# Altium schematic sheet Sheet1.SchDoc
size A3; SheetNumber: 1; SheetTotal: 1
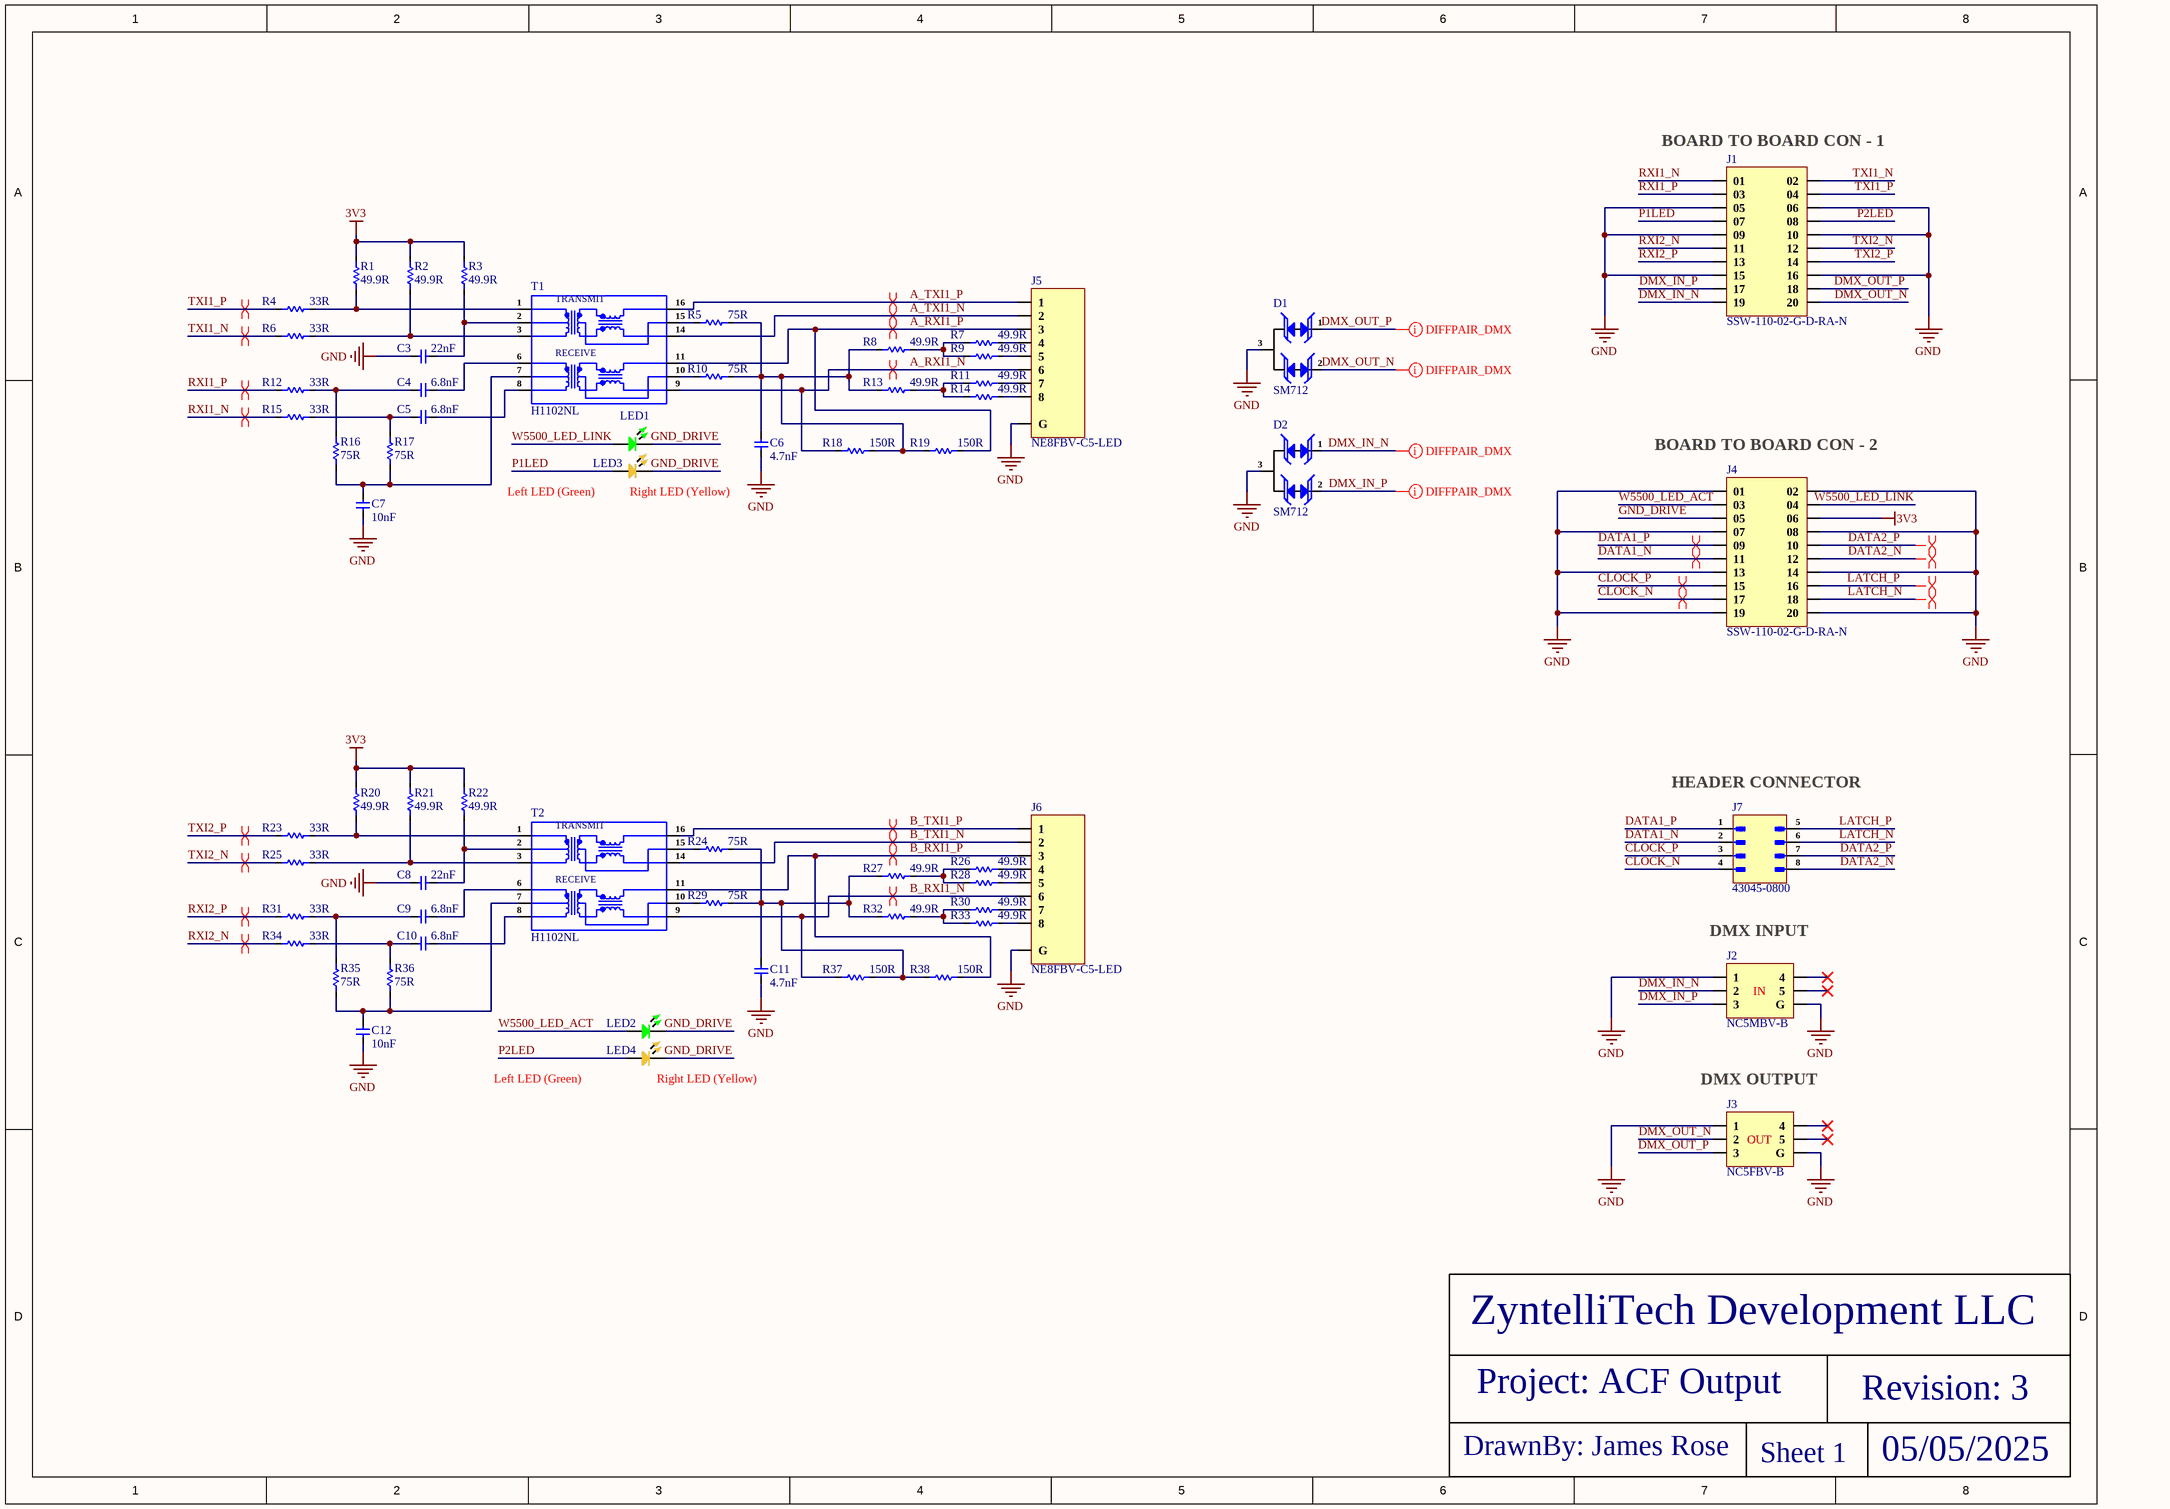
[diagram p0: Sheet1.SchDoc]

## Parts
C3  22nF  [Cap-0603]
C4  6.8nF  [Cap-0603]
C5  6.8nF  [Cap-0603]
C6  4.7nF  [Cap-1206]
C7  10nF  [Cap-0603]
C8  22nF  [Cap-0603]
C9  6.8nF  [Cap-0603]
C10  6.8nF  [Cap-0603]
C11  4.7nF  [Cap-1206]
C12  10nF  [Cap-0603]
D1  SM712  [SOT-23]
D2  SM712  [SOT-23]
J1  SSW-110-02-G-D-RA-N  [SSW-110-02-G-D-RA-N]
J2  NC5MBV-B  [NC5MBV-B]
J3  NC5FBV-B  [NC5FBV-B]
J4  SSW-110-02-G-D-RA-N  [SSW-110-02-G-D-RA-N]
J5  NE8FBV-C5-LED  [NE8FBV-C5-LED]
J6  NE8FBV-C5-LED  [NE8FBV-C5-LED]
J7  43045-0800  [0430450800]
LED1  Emerald  [TH LED 3mm_]  (value not drawn)
LED2  Emerald  [TH LED 3mm_]  (value not drawn)
LED3  Yellow  [TH LED Yellow 3MM]  (value not drawn)
LED4  Yellow  [TH LED Yellow 3MM]  (value not drawn)
R1  49.9R  [Res-0603]
R2  49.9R  [Res-0603]
R3  49.9R  [Res-0603]
R4  33R  [Res-0603]
R5  75R  [Res-0603]
R6  33R  [Res-0603]
R7  49.9R  [Res-0603]
R8  49.9R  [Res-0603]
R9  49.9R  [Res-0603]
R10  75R  [Res-0603]
R11  49.9R  [Res-0603]
R12  33R  [Res-0603]
R13  49.9R  [Res-0603]
R14  49.9R  [Res-0603]
R15  33R  [Res-0603]
R16  75R  [Res-0603]
R17  75R  [Res-0603]
R18  150R  [Res-0603]
R19  150R  [Res-0603]
R20  49.9R  [Res-0603]
R21  49.9R  [Res-0603]
R22  49.9R  [Res-0603]
R23  33R  [Res-0603]
R24  75R  [Res-0603]
R25  33R  [Res-0603]
R26  49.9R  [Res-0603]
R27  49.9R  [Res-0603]
R28  49.9R  [Res-0603]
R29  75R  [Res-0603]
R30  49.9R  [Res-0603]
R31  33R  [Res-0603]
R32  49.9R  [Res-0603]
R33  49.9R  [Res-0603]
R34  33R  [Res-0603]
R35  75R  [Res-0603]
R36  75R  [Res-0603]
R37  150R  [Res-0603]
R38  150R  [Res-0603]
T1  H1102NL  [H1102NLT]
T2  H1102NL  [H1102NLT]

## Nets
3V3: J4.06 R1.1 R2.1 R3.1 R20.1 R21.1 R22.1
GND: C3.1 C6.1 C7.1 C8.1 C11.1 C12.1 D1.3(GND) D2.3(GND) J1.05 J1.06 J1.09 J1.10 J1.15 J1.16 J2.1 J2.G J3.1 J3.G J4.01 J4.02 J4.07 J4.08 J4.13 J4.14 J4.19 J4.20 J5.G J6.G
A_RXI1_N: J5.6 R18.2 T1.9
A_RXI1_P: J5.3 R19.1 T1.11
A_TXI1_N: J5.2 T1.14
A_TXI1_P: J5.1 T1.16
B_RXI1_N: J6.6 R37.2 T2.9
B_RXI1_P: J6.3 R38.1 T2.11
B_TXI1_N: J6.2 T2.14
B_TXI1_P: J6.1 T2.16
CLOCK_N: J4.17 J7.4
CLOCK_P: J4.15 J7.3
DATA1_N: J4.11 J7.2
DATA1_P: J4.09 J7.1
DATA2_N: J4.12 J7.8
DATA2_P: J4.10 J7.7
DMX_IN_N: D2.1(I/O1) J1.19 J2.2
DMX_IN_P: D2.2(I/O2) J1.17 J2.3
DMX_OUT_N: D1.2(I/O2) J1.20 J3.2
DMX_OUT_P: D1.1(I/O1) J1.18 J3.3
GND_DRIVE: J4.05 LED1.1(-) LED2.1(-) LED3.2 LED4.2
LATCH_N: J4.18 J7.6
LATCH_P: J4.16 J7.5
P1LED: J1.07 LED3.1
P2LED: J1.08 LED4.1
RXI1_N: J1.01 R15.1
RXI1_P: J1.03 R12.1
RXI2_N: J1.11 R34.1
RXI2_P: J1.13 R31.1
TXI1_N: J1.02 R6.1
TXI1_P: J1.04 R4.1
TXI2_N: J1.12 R25.1
TXI2_P: J1.14 R23.1
W5500_LED_ACT: J4.03 LED2.2(+)
W5500_LED_LINK: J4.04 LED1.2(+)
NetC3_2: C3.2 R3.2 T1.2
NetC4_1: C4.1 R12.2 R16.1
NetC4_2: C4.2 T1.6
NetC5_1: C5.1 R15.2 R17.1
NetC5_2: C5.2 T1.8
NetC6_2: C6.2 R5.1 R8.2 R10.1 R13.2 R18.1 R19.2
NetC7_2: C7.2 R16.2 R17.2 T1.7
NetC8_2: C8.2 R22.2 T2.2
NetC9_1: C9.1 R31.2 R35.1
NetC9_2: C9.2 T2.6
NetC10_1: C10.1 R34.2 R36.1
NetC10_2: C10.2 T2.8
NetC11_2: C11.2 R24.1 R27.2 R29.1 R32.2 R37.1 R38.2
NetC12_2: C12.2 R35.2 R36.2 T2.7
NetJ5_4: J5.4 R7.1
NetJ5_5: J5.5 R9.1
NetJ5_7: J5.7 R11.1
NetJ5_8: J5.8 R14.1
NetJ6_4: J6.4 R26.1
NetJ6_5: J6.5 R28.1
NetJ6_7: J6.7 R30.1
NetJ6_8: J6.8 R33.1
NetR1_2: R1.2 R4.2 T1.1
NetR2_2: R2.2 R6.2 T1.3
NetR5_2: R5.2 T1.15
NetR7_2: R7.2 R8.1 R9.2
NetR10_2: R10.2 T1.10
NetR11_2: R11.2 R13.1 R14.2
NetR20_2: R20.2 R23.2 T2.1
NetR21_2: R21.2 R25.2 T2.3
NetR24_2: R24.2 T2.15
NetR26_2: R26.2 R27.1 R28.2
NetR29_2: R29.2 T2.10
NetR30_2: R30.2 R32.1 R33.2

Not connected (* = marked no-connect by the designer): J2 4* 5*; J3 4* 5*

## Layout directives
differential pair; differential pair class DIFF-ETH-100; rule Impedance Constraint [Min = 100.0    Max = 110.0    ]; rule Matched Net Lengths [Tolerance = 0.508mm]: A_RXI1_N, A_RXI1_P, A_TXI1_N, A_TXI1_P, B_RXI1_N, B_RXI1_P, B_TXI1_N, B_TXI1_P, CLOCK_N, CLOCK_P, DATA1_N, DATA1_P, DATA2_N, DATA2_P, LATCH_N, LATCH_P, RXI1_N, RXI1_P, RXI2_N, RXI2_P, TXI1_N, TXI1_P, TXI2_N, TXI2_P
differential pair; differential pair class DIFF-DMX-120; rule Impedance Constraint [Min = 110.0    Max = 120.0    ]; rule Matched Net Lengths [Tolerance = 0.508mm]: DMX_IN_N, DMX_IN_P, DMX_OUT_N, DMX_OUT_P

## Notes on the sheet
- (near J1) BOARD TO BOARD CON - 1
- (near J4) BOARD TO BOARD CON - 2
- (near LED3) Left LED (Green)
- (near LED3) Right LED (Yellow)
- (near J7) HEADER CONNECTOR
- (near J2) IN
- DMX INPUT
- Left LED (Green)
- (near LED4) Right LED (Yellow)
- (near J3) DMX OUTPUT
- (near J3) OUT
- ZyntelliTech Development LLC
- Project: ACF Output
- DrawnBy: James Rose
- Revision: 3
- Sheet 1
- 05/05/2025
- ZyntelliTech
- File:
- Title:
- Date:
- Page
- Num:
- Total:
- Drawn By: Huzaifa Ali
- (in symbol H1102NL) TRANSMIT; RECEIVE

## Library data of the parts
C3 C8 = CC0603KRX7R9BB223: CAP CER 0.022UF 50V X7R 0603; Manufacturer: Yageo; Dielectric Material: Ceramic; Tolerance: 10%; Insulation Resistance: 100GR; Item Type: Capacitor; Supplier 1: Digi-Key; Manufacturer Part Number: CC0603KRX7R9BB223; RoHS: Yes; Category: Ceramic Capacitors; Stock 1: 119735; Pricing 1: 1=0.10000, 10=0.05500, 50=0.03020, 100=0.02460, 500=0.01760, 1000=0.01383 (USD); Mount: Surface Mount; Case/Package: 0603; Number of Pins: 2; Case Code (Metric): 1608; Case Code (Imperial): 0603; Min Operating Temperature: -55°C; Max Operating Temperature: 125°C; Capacitance: 22nF; Dielectric: X7R; Voltage: 50V; Package Quantity: 1; Voltage Rating: 50V; Packaging: Tape and Reel; Voltage Rating (DC): 50V; Termination: SMD/SMT; Resistor Type: Ceramic; Series: CC; Length: 1.6mm; Width: 0.031inch; Height: 0.8mm; Depth: 0.8mm; Thickness: 0.035inch; Radiation Hardening: No; RoHS Compliant: Yes; REACH SVHC: No SVHC; Lead Free: Lead Free; Halogen Free: Halogen Free; ComponentLink1URL: https://datasheet.ciiva.com/8033/70765-8033869.pdf?src-supplier=Element14; ComponentLink1Description: https://datasheet.ciiva.com/8033/70765-8033869.pdf?src-supplier=Element14; ComponentLink2URL: https://datasheet.ciiva.com/28450/1489800-28450639.pdf?src-supplier=Element14; ComponentLink2Description: https://datasheet.ciiva.com/28450/1489800-28450639.pdf?src-supplier=Element14; ComponentLink3URL: https://datasheet.ciiva.com/8033/1489800-8033867.pdf?src-supplier=Element14; ComponentLink3Description: https://datasheet.ciiva.com/8033/1489800-8033867.pdf?src-supplier=Element14; ComponentLink4URL: https://datasheet.ciiva.com/8033/1489800-8033865.pdf?src-supplier=Element14; ComponentLink4Description: https://datasheet.ciiva.com/8033/1489800-8033865.pdf?src-supplier=Element14; ComponentLink5URL: https://datasheet.ciiva.com/156/mlccorderingcode-156178.pdf?src-supplier=Digi-Key; ComponentLink5Description: https://datasheet.ciiva.com/156/mlccorderingcode-156178.pdf?src-supplier=Digi-Key; ComponentLink6URL: https://datasheet.ciiva.com/156/mlccorderingcode-156177.pdf?src-supplier=Digi-Key; ComponentLink6Description: https://datasheet.ciiva.com/156/mlccorderingcode-156177.pdf?src-supplier=Digi-Key; ComponentLink7URL: https://datasheet.ciiva.com/156/mlccorderingcode-156179.pdf?src-supplier=Digi-Key; ComponentLink7Description: https://datasheet.ciiva.com/156/mlccorderingcode-156179.pdf?src-supplier=Digi-Key; ComponentLink8URL: https://datasheet.ciiva.com/11464/upy-gphc-x7r-6-3v-to-50v-8-11464741.pdf?src-supplier=Avnet; ComponentLink8Description: https://datasheet.ciiva.com/11464/upy-gphc-x7r-6-3v-to-50v-8-11464741.pdf?src-supplier=Avnet; Supplier Part Number 1: 311-1370-1-ND; LCSC Part Number: C106222
C4 C5 C9 C10 = 0603B682K500NT: 50V 6.8nF X7R ±10% 0603; Manufacturer: FH; Item Type: Capacitor; ComponentLink1Description: LCSC; ComponentLink1URL: https://www.lcsc.com/product-detail/Multilayer-Ceramic-Capacitors-MLCC-SMD-SMT_FH-Guangdong-Fenghua-Advanced-Tech-0603B682K500NT_C1631.html; Manufacturer Part Number: 0603B682K500NT; Footprint: 0603; Value: 6.8nF; LCSC Part Number: C1631
C6 C11 = CC1206KKX7RCBB472: CAP CER 4700PF 1KV X7R 1206; Manufacturer: Yageo; Dielectric Material: Ceramic; Tolerance: 10%; Item Type: Capacitor; Supplier 1: Future Electronics; Manufacturer Part Number: CC1206KKX7RCBB472; RoHS: Yes; Category: Ceramic Capacitors; Stock 1: 180000; Pricing 1: 3000=0.02860, 9000=0.02750, 15000=0.02700, 45000=0.02600, 75000=0.02510 (USD); Mount: Surface Mount; Case/Package: 1206; Number of Pins: 2; Case Code (Imperial): 1206; Case Code (Metric): 3216; Weight: 0.000571oz; Min Operating Temperature: -55°C; Max Operating Temperature: 125°C; Voltage Rating: 1kV; Capacitance: 4.7nF; Packaging: Tape and Reel; Voltage Rating (DC): 1kV; Dielectric: X7R; Termination: SMD/SMT; Resistor Type: Ceramic; Series: CC; Length: 3.2mm; Width: 0.063inch; Thickness: 0.057inch; Depth: 1.6mm; Radiation Hardening: No; Lead Free: Lead Free; RoHS Compliant: Yes; ComponentLink1URL: https://datasheet.ciiva.com/13208/upy-gp-np0-16v-to-50v-8-13208693.pdf?src-supplier=Mouser; ComponentLink1Description: https://datasheet.ciiva.com/13208/upy-gp-np0-16v-to-50v-8-13208693.pdf?src-supplier=Mouser; ComponentLink2URL: https://datasheet.ciiva.com/11466/hv-11466701.pdf?src-supplier=Avnet; ComponentLink2Description: https://datasheet.ciiva.com/11466/hv-11466701.pdf?src-supplier=Avnet; Supplier Part Number 1: 7130131; LCSC Part Number: C107198
C7 C12 = CC0603KRX7R0BB103: CAP CER 10000PF 100V X7R 0603; Manufacturer: Yageo; Item Type: Capacitor; Dielectric Material: Ceramic; Tolerance: 10%; Supplier: Future Electronics; LCSC Part Number: C107059; Manufacturer Part Number: CC0603KRX7R0BB103; RoHS: Yes; Stock: 788000; Pricing: 4000=0.0051, 16000=0.0048, 60000=0.0045, 160000=0.0043, 400000=0.0041 (USD); Mounting Technology: Surface Mount; Case/Package: 0603; Case Code (Imperial): 0603; Case Code (Metric): 1608; Min Operating Temperature: -55°C; Max Operating Temperature: 125°C; Value: 10nF; Dielectric: X7R; Voltage Rating: 100V; Packaging: Tape and Reel; Package Quantity: 4000; Voltage Rating (DC): 100V; Termination: SMD/SMT; Series: CC; Construction: Flat; Length: 1.6mm; Width: 0.031inch; Height: 0.8mm; Thickness: 0.035inch; Depth: 0.8mm; Radiation Hardening: No; Lead Free: Lead Free; RoHS Compliant: Yes; Reach SVHC Compliant: Unknown; ComponentLink1URL: https://datasheet.ciiva.com/8033/1669968-8033774.pdf?src-supplier=Element14; ComponentLink1Description: https://datasheet.ciiva.com/8033/1669968-8033774.pdf?src-supplier=Element14; ComponentLink2URL: https://datasheet.ciiva.com/13389/upy-gphc-x7r-6-3v-to-50v-8-13389353.pdf?src-supplier=Mouser; ComponentLink2Description: https://datasheet.ciiva.com/13389/upy-gphc-x7r-6-3v-to-50v-8-13389353.pdf?src-supplier=Mouser; ComponentLink3URL: https://datasheet.ciiva.com/17458/upy-np0x7r-mv-100-to-630v-9-17458073.pdf?src-supplier=Future+Electronics; ComponentLink3Description: https://datasheet.ciiva.com/17458/upy-np0x7r-mv-100-to-630v-9-17458073.pdf?src-supplier=Future+Electronics; ComponentLink4URL: https://datasheet.ciiva.com/26829/getdatasheetpartid-626135-26829418.pdf?src-supplier=Verical; ComponentLink4Description: https://datasheet.ciiva.com/26829/getdatasheetpartid-626135-26829418.pdf?src-supplier=Verical
D1 D2 = SM712: SOT-23 TVS ROHS; Manufacturer: TECH PUBLIC; Item Type: Diode; Manufacturer Part Number: SM712; Package: SOT-23; LCSC Part Number: C521963; ComponentLink1Description: LCSC; ComponentLink1URL: https://www.lcsc.com/product-detail/TVS_TECH-PUBLIC-SM712_C521963.html
J1 J4 = SSW-110-02-G-D-RA-N: CONN RCPT 20POS 0.1 GOLD PCB R/A; Manufacturer: Samtec; Item Type: Connectors; Gender: 30Gender; Supplier: Digikey; Manufacturer Part Number: SSW-110-02-G-D-RA-N; RoHS: Yes; Stock: 310; Pricing: 1=3.59, 25=3.5052, 50=3.4236, 100=3.2605, 500=2.43324, 1000=2.11363, 2500=1.908 (USD); ComponentLink1URL: ftp://ftp.samtec.com/webfiles/PDF/SSQ_TH.PDF?src-supplier=Avnet; ComponentLink1Description: ftp://ftp.samtec.com/webfiles/PDF/SSQ_TH.PDF?src-supplier=Avnet; ComponentLink2URL: https://datasheet.octopart.com/SSW-110-02-G-D-RA-N-Samtec-datasheet-160481827.pdf?src-supplier=Toby+Electronics; ComponentLink2Description: https://datasheet.octopart.com/SSW-110-02-G-D-RA-N-Samtec-datasheet-160481827.pdf?src-supplier=Toby+Electronics; ComponentLink3URL: https://datasheet.octopart.com/SSW-110-02-G-D-RA-N-Samtec-datasheet-118235309.pdf?src-supplier=Sager+Electronics; ComponentLink3Description: https://datasheet.octopart.com/SSW-110-02-G-D-RA-N-Samtec-datasheet-118235309.pdf?src-supplier=Sager+Electronics; ComponentLink4URL: https://datasheet.octopart.com/SSW-110-02-G-D-RA-N-Samtec-datasheet-184263327.pdf?src-supplier=Master+Electronics; ComponentLink4Description: https://datasheet.octopart.com/SSW-110-02-G-D-RA-N-Samtec-datasheet-184263327.pdf?src-supplier=Master+Electronics
J2 = NC5MBV-B: XLR Connectors 5P M RECEPT B SER PCBV PN 1 GRD SEP BK; Manufacturer: Neutrik; Item Type: Audio / Video Connectors; Supplier: Mouser; Supplier Part Number: 568-NC5MBV-B; Manufacturer Part Number: NC5MBV-B; RoHS: Yes; Stock: 99; Pricing: 1=8.81, 10=8.81, 50=8.81, 100=8.81, 1000=6.68, 10000=6.68 (USD); ComponentLink1URL: https://datasheet.ciiva.com/30093/nc5mbv-b-neutrik-30093926.pdf?src-supplier=Onlinecomponents.com; ComponentLink1Description: https://datasheet.ciiva.com/30093/nc5mbv-b-neutrik-30093926.pdf?src-supplier=Onlinecomponents.com
J3 = NC5FBV-B: XLR Connectors 5P M RECEPT B SER PCBV PN 1 GRD SEP BK; Manufacturer: Neutrik; Supplier: Mouser; Supplier Part Number: 568-NC5FBV-B; Manufacturer Part Number: NC5FBV-B; RoHS: Yes; Item Type: Connectors; Stock: 259; Pricing: 1=8.46, 10=8.46, 50=8.46, 100=8.46, 1000=6.34, 10000=6.34 (USD); ComponentLink1URL: https://datasheet.ciiva.com/30205/nc5fbv-b-neutrik-30205399.pdf?src-supplier=Onlinecomponents.com; ComponentLink1Description: https://datasheet.ciiva.com/30205/nc5fbv-b-neutrik-30205399.pdf?src-supplier=Onlinecomponents.com
J5 J6 = NE8FBV-C5-LED: Modular Connectors / Ethernet Connectors RECP CAT5e B series PCBV, 24mm FP to PCB; Manufacturer: Neutrik; Item Type: Modular / Ethernet Connectors; Supplier: Mouser; Supplier Part Number: 568-NE8FBV-C5-LED; Manufacturer Part Number: NE8FBV-C5-LED; RoHS: Yes; Stock: 1959; Pricing: 1=12.51, 10=11.24, 50=11.24, 100=9.55, 1000=9.54, 10000=9.54 (USD); ComponentLink1URL: http://www.alliedelec.com/images/products/datasheets/bm/NEUTRIK_PRODUCTS/70624710.pdf?src-supplier=Allied+Electronics; ComponentLink1Description: http://www.alliedelec.com/images/products/datasheets/bm/NEUTRIK_PRODUCTS/70624710.pdf?src-supplier=Allied+Electronics; ComponentLink2URL: http://www.farnell.com/datasheets/2040666.pdf?src-supplier=Element14; ComponentLink2Description: http://www.farnell.com/datasheets/2040666.pdf?src-supplier=Element14; ComponentLink3URL: https://datasheet.octopart.com/NE8FBV-C5-LED-Neutrik-datasheet-62313259.pdf?src-supplier=Newark; ComponentLink3Description: https://datasheet.octopart.com/NE8FBV-C5-LED-Neutrik-datasheet-62313259.pdf?src-supplier=Newark
J7 = 43045-0800: CONN HEADER R/A 8POS 3MM; Manufacturer: Molex; Item Type: Headers and Wire Housings; Plating: Tin; Contact Resistance: 10mR; Max Voltage Rating (DC): 250.25kV; Current Rating: 5A; Number of Poles: 8; Voltage Rating (AC): 250V; Voltage Rating: 600V; Gender: Male; Approvals: UL,CSA,TUV; Glow Wire Compliant: Compliant; Supplier: Arrow Electronics; Supplier Part Number: 43045-0800; Manufacturer Part Number: 43045-0800; RoHS: Yes; Stock: 99682; Pricing: 1=0.8079, 10=0.7846, 100=0.7589, 500=0.7388, 1440=0.7241, 5760=0.7046 (USD); Mounting Technology: Through Hole; Case/Package: SMC; Contact Plating: Tin; Contact Material: Brass,Tin; Color: Black; Material: Polyester; Housing Color: Black; Housing Material: Thermoplastic; Min Operating Temperature: -40°C; Max Operating Temperature: 105°C; Number of Rows: 2; Package Quantity: 1440; Packaging: Tray; Max Current Rating: 5A; Number of Positions: 8; Termination: Solder; Number of Contacts: 8; Number of Circuits: 8; Working Voltage: 250V; Orientation: Right Angle; Voltage Rating (DC): 250V; Series: 43045; Diameter: 3mm; Length: 16.15mm; Height: 8.77mm; Pitch: 3mm; Row Spacing: 3mm; Depth: 12.2mm; Radiation Hardening: No; Halogen Free: Low Halogen; Lead Free: Lead Free; Flammability Rating: UL94 V-0; RoHS Compliant: Yes; Reach SVHC Compliant: Unknown; ComponentLink1URL: https://datasheet.ciiva.com/11751/0900766b80027348-11751142.pdf?src-supplier=Rs; ComponentLink1Description: https://datasheet.ciiva.com/11751/0900766b80027348-11751142.pdf?src-supplier=Rs; ComponentLink2URL: https://datasheet.ciiva.com/14155/04402310-14155206.pdf?src-supplier=Distrelec; ComponentLink2Description: https://datasheet.ciiva.com/14155/04402310-14155206.pdf?src-supplier=Distrelec; ComponentLink3URL: https://datasheet.ciiva.com/1443/1850016-1443537.pdf?src-supplier=Element14; ComponentLink3Description: https://datasheet.ciiva.com/1443/1850016-1443537.pdf?src-supplier=Element14
LED1 LED2 = NFD3401UGD: 515nm~525nm -30℃~+85℃ Emerald 30° 200mW Plugin,D=3mm Light Emitting Diodes (LED) ROHS; Manufacturer: Foshan NationStar Optoelectronics; Manufacturer Part Number: NFD3401UGD; Package: Plugin,D=3mm; LCSC Part Number: C20618151; Item Type: LED; ComponentLink1Description: LCSC; ComponentLink1URL: https://www.lcsc.com/product-detail/Light-Emitting-Diodes-LED_Foshan-NationStar-Optoelectronics-NFD3401URD_C20618148.html
LED3 LED4 = NFD3401UYD: 585nm~595nm -30℃~+85℃ Yellow 30° 200mW Plugin,D=3mm Light Emitting Diodes (LED) ROHS; Manufacturer: Foshan NationStar Optoelectronics; Manufacturer Part Number: NFD3401UYD; Package: Plugin,D=3mm; LCSC Part Number: C20618149; Item Type: LED; ComponentLink1Description: LCSC; ComponentLink1URL: https://www.lcsc.com/product-detail/Light-Emitting-Diodes-LED_Foshan-NationStar-Optoelectronics-NFD3401UYD_C20618149.html
R1-R3 R7-R9 R11 R13 R14 R20-R22 R26-R28 R30 R32 R33 = RC0603FR-0749R9L: RES 49.9 OHM 1% 1/10W 0603; Manufacturer: Yageo; Temperature Coefficient: 100ppm/°C; Voltage Rating (DC): 50V; Power Rating: 100mW; Item Type: Resistor; Supplier 1: Arrow Electronics; Manufacturer Part Number: RC0603FR-0749R9L; RoHS: Yes; Category: Chip SMD Resistors; Stock 1: 2075000; Pricing 1: 5000=0.00280 (USD); Case/Package: 0603; Number of Pins: 2; Case Code (Imperial): 0603; Case Code (Metric): 1608; Size Code: 0603; Min Operating Temperature: -55°C; Max Operating Temperature: 155°C; Tolerance: 1%; Resistance: 49.9R; Resistor Type: Thick Film; Packaging: Tape and Reel; Voltage Rating: 50V; Termination: SMD/SMT; Features: Moisture Resistant; Series: RC; Max Power Dissipation: 100mW; Number of Terminations: 2; Construction: Rectangular; Resistance Tolerance: 1%; Technology: THICK FILM; Length: 1.6mm; Height: 0.45mm; Depth: 0.8mm; Lead Free: Lead Free; REACH SVHC: No SVHC; Military Standard: Not; RoHS Compliant: Yes; ComponentLink1URL: https://datasheet.ciiva.com/11808/0900766b80f96399-11808223.pdf?src-supplier=RSComponents; ComponentLink1Description: https://datasheet.ciiva.com/11808/0900766b80f96399-11808223.pdf?src-supplier=RSComponents; ComponentLink2URL: https://datasheet.ciiva.com/22747/443971-22747527.pdf?src-supplier=Element14; ComponentLink2Description: https://datasheet.ciiva.com/22747/443971-22747527.pdf?src-supplier=Element14; ComponentLink3URL: https://datasheet.ciiva.com/15189/getdatasheetpartid-325421-15189750.pdf?src-supplier=Verical; ComponentLink3Description: https://datasheet.ciiva.com/15189/getdatasheetpartid-325421-15189750.pdf?src-supplier=Verical; Supplier Part Number 1: RC0603FR-0749R9L; LCSC Part Number: C114625
R4 R6 R12 R15 R23 R25 R31 R34 = RC0603FR-0733RL: RES SMD 0603 33 Ohm 1% 1/10W; Manufacturer: Yageo; Temperature Coefficient: 100ppm/°C; Voltage Rating (DC): 50V; Power Rating: 100mW; Voltage Rating: 75V; Item Type: Resistor; Supplier 1: Digi-Key; Manufacturer Part Number: RC0603FR-0733RL; RoHS: Yes; Category: Chip SMD Resistors; Stock 1: 41; Pricing 1: 1=0.10000, 10=0.02400, 100=0.00970, 1000=0.00436, 2500=0.00378 (USD); Case/Package: 0603; Number of Pins: 2; Case Code (Metric): 1608; Case Code (Imperial): 0603; Weight: 7.1E-05oz; Size Code: 0603; Min Operating Temperature: -55°C; Max Operating Temperature: 155°C; Resistance: 33R; Tolerance: 1%; Resistor Type: Thick Film; Packaging: Tape and Reel; Package Quantity: 1; Number of Terminations: 2; Termination: SMD/SMT; Max Power Dissipation: 100mW; Features: Moisture Resistant; Series: RC; Resistance Tolerance: 1%; Technology: THICK FILM; Construction: Rectangular; Length: 1.6mm; Width: 0.8mm; Height: 0.45mm; Depth: 0.8mm; Lead Pitch: 0.3mm; REACH SVHC: No SVHC; Lead Free: Lead Free; Military Standard: Not; RoHS Compliant: Yes; ComponentLink1URL: https://datasheet.ciiva.com/11808/0900766b80f96399-11808741.pdf?src-supplier=RSComponents; ComponentLink1Description: https://datasheet.ciiva.com/11808/0900766b80f96399-11808741.pdf?src-supplier=RSComponents; ComponentLink2URL: https://datasheet.ciiva.com/2453/pyu-r-int-thick-7-2453952.pdf?src-supplier=Digi-Key; ComponentLink2Description: https://datasheet.ciiva.com/2453/pyu-r-int-thick-7-2453952.pdf?src-supplier=Digi-Key; ComponentLink3URL: https://datasheet.ciiva.com/2453/pyu-r-int-thick-7-2453953.pdf?src-supplier=Digi-Key; ComponentLink3Description: https://datasheet.ciiva.com/2453/pyu-r-int-thick-7-2453953.pdf?src-supplier=Digi-Key; ComponentLink4URL: https://datasheet.ciiva.com/2453/pyu-r-int-thick-7-2453954.pdf?src-supplier=Digi-Key; ComponentLink4Description: https://datasheet.ciiva.com/2453/pyu-r-int-thick-7-2453954.pdf?src-supplier=Digi-Key; ComponentLink5URL: https://datasheet.ciiva.com/7660/38590-7660792.pdf?src-supplier=Element14; ComponentLink5Description: https://datasheet.ciiva.com/7660/38590-7660792.pdf?src-supplier=Element14; ComponentLink6URL: https://datasheet.ciiva.com/15189/getdatasheetpartid-326673-15189708.pdf?src-supplier=Verical; ComponentLink6Description: https://datasheet.ciiva.com/15189/getdatasheetpartid-326673-15189708.pdf?src-supplier=Verical; ComponentLink7URL: https://datasheet.ciiva.com/7746/443971-7746334.pdf?src-supplier=Element14; ComponentLink7Description: https://datasheet.ciiva.com/7746/443971-7746334.pdf?src-supplier=Element14; ComponentLink8URL: https://datasheet.ciiva.com/7746/443971-7746335.pdf?src-supplier=Element14; ComponentLink8Description: https://datasheet.ciiva.com/7746/443971-7746335.pdf?src-supplier=Element14; ComponentLink9URL: https://datasheet.ciiva.com/46395/443971-46395007.pdf?src-supplier=Element14; ComponentLink9Description: https://datasheet.ciiva.com/46395/443971-46395007.pdf?src-supplier=Element14; Supplier Part Number 1: 311-33.0HRCT-ND; LCSC Part Number: C108661
R5 R10 R16 R17 R24 R29 R35 R36 = RC0603FR-0775RL: RES 75 OHM 1% 1/10W 0603; Manufacturer: Yageo; Temperature Coefficient: 100ppm/°C; Voltage Rating (DC): 50V; Power Rating: 100mW; Item Type: Resistor; Supplier: Digikey; Supplier Part Number: 311-75.0HRCT-ND; Manufacturer Part Number: RC0603FR-0775RL; RoHS: Yes; Category: Chip SMD Resistors; Stock: 844005; Pricing: 1=0.1, 10=0.019, 50=0.0112, 100=0.0093, 500=0.00622, 1000=0.00532 (USD); Case/Package: 0603; Case Code (Metric): 1608; Case Code (Imperial): 0603; Min Operating Temperature: -55°C; Max Operating Temperature: 155°C; Value: 75R; Tolerance: 1%; Resistor Type: Thick Film; Packaging: Tape and Reel; Voltage Rating: 50V; Package Quantity: 1; Number of Terminations: 2; Termination: SMD/SMT; Max Power Dissipation: 100mW; Features: Moisture Resistant; Series: RC; Resistance Tolerance: 1%; Construction: Rectangular; Technology: THICK FILM; Length: 0.063inch; Width: 0.031inch; Height: 0.022inch; Depth: 0.8mm; Lead Free: 5697LeadFree; Reach SVHC Compliant: No; Military Standard: Not; RoHS Compliant: Yes; LCSC Part Number: C112309
R18 R19 R37 R38 = RC0603FR-07150RL: RES SMD 150OHM 1/10W 0603; Manufacturer: Yageo; Tolerance: 1%; Power Rating: 100mW; Voltage Rating (DC): 50V; Temperature Coefficient: 100ppm/°C; Supplier 1: Digi-Key; Manufacturer Part Number: RC0603FR-07150RL; RoHS: Yes; Category: Chip SMD Resistors; Stock 1: 263721; Pricing 1: 1=0.10000, 10=0.02400, 100=0.00970, 1000=0.00436, 2500=0.00378 (USD); Case/Package: 0603; Number of Pins: 2; Case Code (Imperial): 0603; Case Code (Metric): 1608; Size Code: 0603; Min Operating Temperature: -55°C; Max Operating Temperature: 155°C; Resistance: 150R; Packaging: Tape and Reel; Voltage Rating: 50V; Package Quantity: 5000; Termination: SMD/SMT; Resistor Type: Thick Film; Features: Moisture Resistant; Series: RC; Max Power Dissipation: 100mW; Number of Terminations: 2; Resistance Tolerance: 1%; Construction: Rectangular; Length: 1.6mm; Width: 0.8mm; Height: 0.45mm; Depth: 0.8mm; REACH SVHC: No SVHC; Lead Free: Lead Free; Military Standard: Not; RoHS Compliant: Yes; ComponentLink1URL: https://datasheet.ciiva.com/46412/443971-46412844.pdf?src-supplier=Element14; ComponentLink1Description: https://datasheet.ciiva.com/46412/443971-46412844.pdf?src-supplier=Element14; ComponentLink2URL: https://datasheet.ciiva.com/46440/1868787-46440893.pdf?src-supplier=Element14; ComponentLink2Description: https://datasheet.ciiva.com/46440/1868787-46440893.pdf?src-supplier=Element14; ComponentLink3URL: https://datasheet.ciiva.com/12555/rc0603-272842-12555301.pdf?src-supplier=Mouser; ComponentLink3Description: https://datasheet.ciiva.com/12555/rc0603-272842-12555301.pdf?src-supplier=Mouser; Supplier Part Number 1: 311-150HRCT-ND; LCSC Part Number: C114608
T1 T2 = H1102NL: XFRMR MAGNETIC 1PORT 1:1 10/100; Manufacturer: Pulse; Shielding: Unshielded; Isolation Voltage: 1.5kV; Insertion Loss: -1.1dB; Return Loss: -11.5dB; Lead/Base Style: Gull Wing; DC Resistance (DCR): 650mR; Value: 350uH; Item Type: RJ45 Transformer; Supplier: Avnet; Supplier Part Number: H1102NL; Manufacturer Part Number: H1102NL; RoHS: Yes; Category: Transformers; Stock: 500; Pricing: 1=3.05066, 10=2.98754, 30=2.92442, 50=2.8613, 100=2.79819, 250=2.73507, 500=2.68247 (USD); Mounting Technology: Surface Mount; Case/Package: Module; Pins: 16; Weight: 0.098767oz; Min Operating Temperature: 0°C; Max Operating Temperature: 70°C; Packaging: Rail/Tube; Package Quantity: 40; Turns Ratio: 1:1; Termination: SMD/SMT; Series: -; Length: 12.7mm; Width: 7.11mm; Height: 6.09mm; Depth: 9.53mm; Height - Seated (Max): 6.22mm; Radiation Hardening: No; RoHS Compliant: Yes; Lead Free: Lead Free; ComponentLink1URL: https://datasheet.ciiva.com/2938/10-100base-tsingleportsmdmagnetics-rev2008-2938779.pdf?src-supplier=Digikey; ComponentLink1Description: https://datasheet.ciiva.com/2938/10-100base-tsingleportsmdmagnetics-rev2008-2938779.pdf?src-supplier=Digikey; LCSC Part Number: C18584